# Altium schematic sheet Muller-C1.SchDoc
size 429 x 344 mm
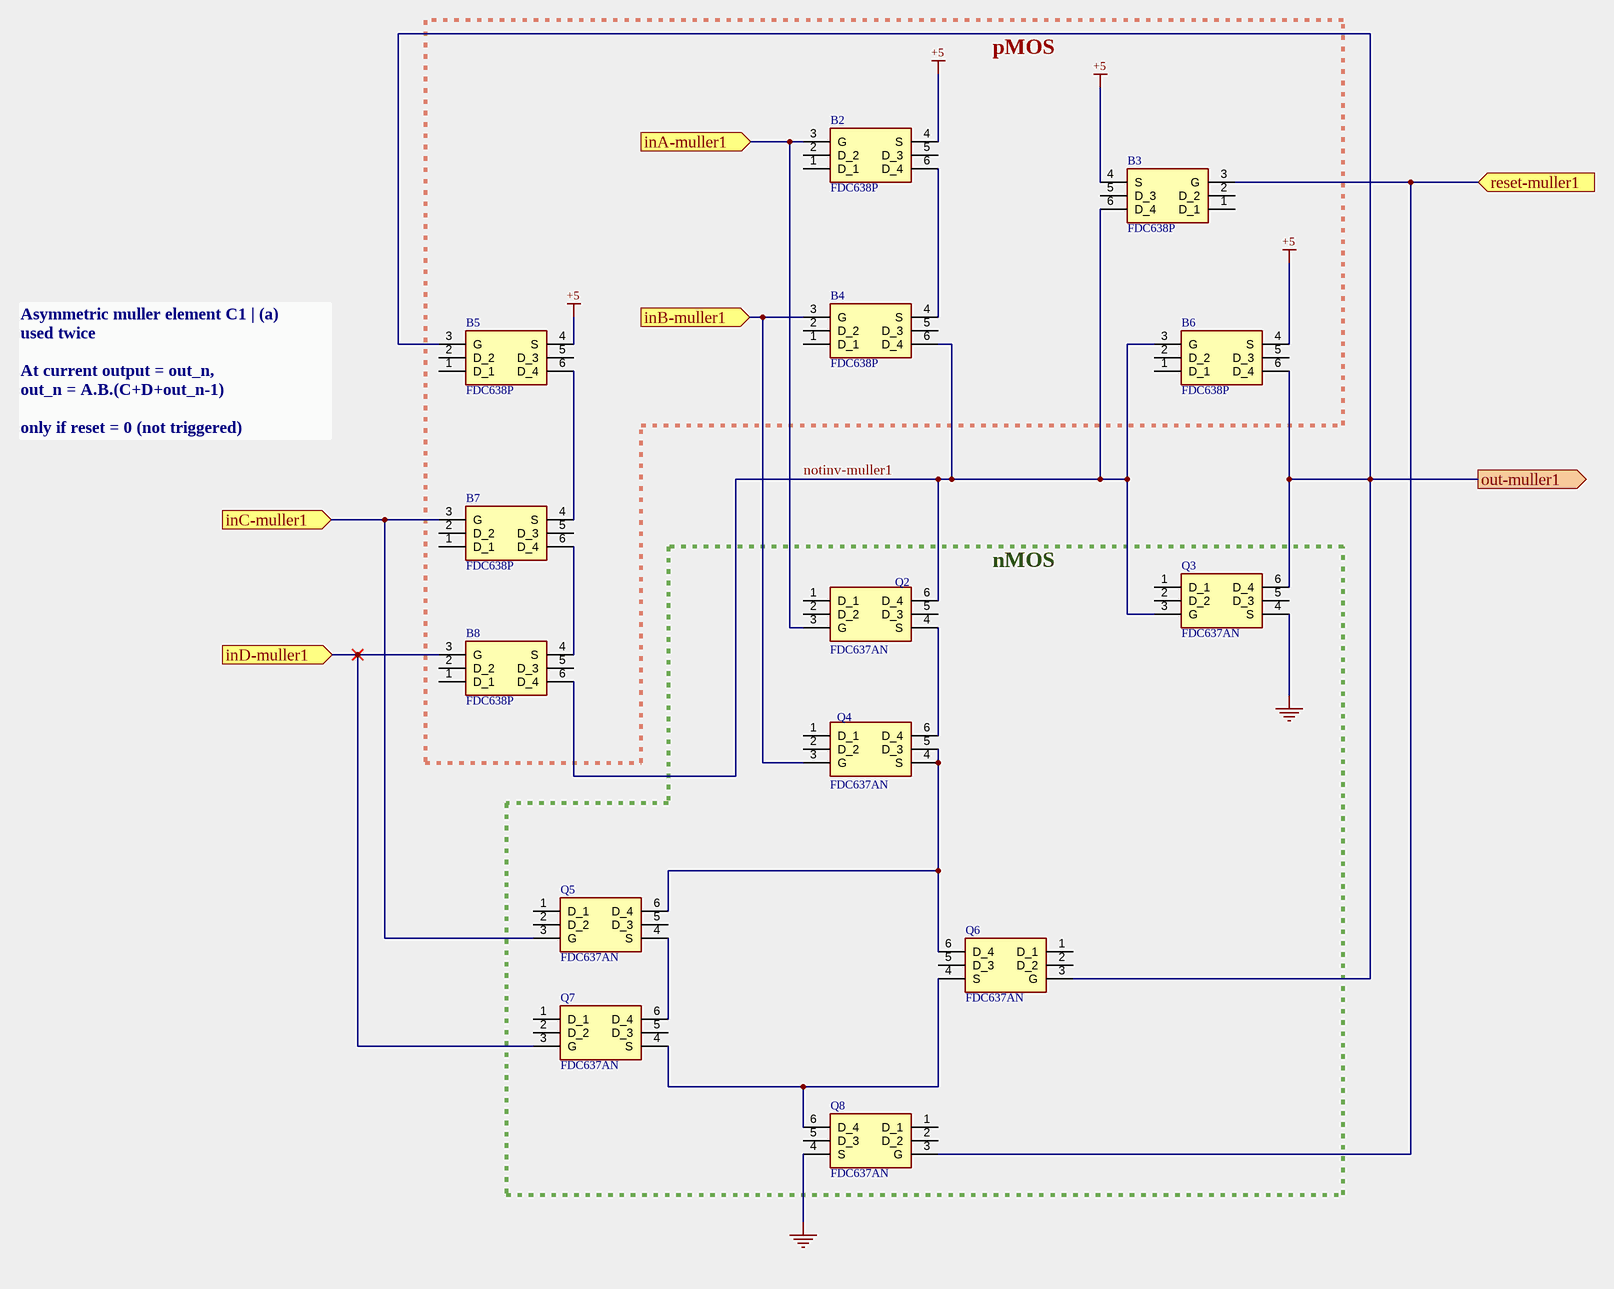
[diagram p0: Muller-C1.SchDoc]

## Parts
B2  FDC638P  [SOT95P275X110-6N]
B3  FDC638P  [SOT95P275X110-6N]
B4  FDC638P  [SOT95P275X110-6N]
B5  FDC638P  [SOT95P275X110-6N]
B6  FDC638P  [SOT95P275X110-6N]
B7  FDC638P  [SOT95P275X110-6N]
B8  FDC638P  [SOT95P275X110-6N]
Q2  FDC637AN  [SOT95P275X110-6N]
Q3  FDC637AN  [SOT95P275X110-6N]
Q4  FDC637AN  [SOT95P275X110-6N]
Q5  FDC637AN  [SOT95P275X110-6N]
Q6  FDC637AN  [SOT95P275X110-6N]
Q7  FDC637AN  [SOT95P275X110-6N]
Q8  FDC637AN  [SOT95P275X110-6N]

## Blocks framed on the sheet
pMOS: B2-B8
nMOS: Q2-Q8

## Ports
inA-muller1 (in), inB-muller1 (in), inC-muller1 (in), inD-muller1 (in), out-muller1 (out), reset-muller1 (in)

## Nets
+5: B2.4(S) B3.4(S) B5.4(S) B6.4(S)
GND: Q3.4(S) Q8.4(S)
inA-muller1: B2.3(G) Q2.3(G) ; port inA-muller1
inB-muller1: B4.3(G) Q4.3(G) ; port inB-muller1
inC-muller1: B7.3(G) Q5.3(G) ; port inC-muller1
inD-muller1: B8.3(G) Q7.3(G) ; port inD-muller1
notinv-muller1: B3.6(D_4) B4.6(D_4) B6.3(G) B8.6(D_4) Q2.6(D_4) Q3.3(G)
out-muller1: B5.3(G) B6.6(D_4) Q3.6(D_4) Q6.3(G) ; port out-muller1
reset-muller1: B3.3(G) Q8.3(G) ; port reset-muller1
NetB2_6: B2.6(D_4) B4.4(S)
NetB5_6: B5.6(D_4) B7.4(S)
NetB7_6: B7.6(D_4) B8.4(S)
NetQ2_4: Q2.4(S) Q4.6(D_4)
NetQ4_4: Q4.4(S) Q4.5(D_3) Q5.6(D_4) Q6.6(D_4)
NetQ5_4: Q5.4(S) Q7.6(D_4)
NetQ6_4: Q6.4(S) Q7.4(S) Q8.6(D_4)

Not connected (* = marked no-connect by the designer): B2 1(D_1) 2(D_2) 5(D_3); B3 1(D_1) 2(D_2) 5(D_3); B4 1(D_1) 2(D_2) 5(D_3); B5 1(D_1) 2(D_2) 5(D_3); B6 1(D_1) 2(D_2) 5(D_3); B7 1(D_1) 2(D_2) 5(D_3); B8 1(D_1) 2(D_2) 5(D_3); Q2 1(D_1) 2(D_2) 5(D_3); Q3 1(D_1) 2(D_2) 5(D_3); Q4 1(D_1) 2(D_2); Q5 1(D_1) 2(D_2) 5(D_3); Q6 1(D_1) 2(D_2) 5(D_3); Q7 1(D_1) 2(D_2) 5(D_3); Q8 1(D_1) 2(D_2) 5(D_3)

## Notes on the sheet
- Asymmetric muller element C1 | (a)
  used twice
  At current output = out_n,
  out_n = A.B.(C+D+out_n-1)
  only if reset = 0 (not triggered)

## Library data of the parts
B2-B8 = CMP-007-000000-1: Low gate charge (10 nC typical); Manufacturer_Name: onsemi; Geometry.Height: 1.1mm; Datasheet Link: https://www.onsemi.com/pub/Collateral/FDC638P-D.PDF; Arrow Price/Stock: *; Design Item ID: FDC638P; Mouser Part Number: 512-FDC638P; Manufacturer_Part_Number: FDC638P; Mouser Price/Stock: https://www.mouser.co.uk/ProductDetail/onsemi-Fairchild/FDC638P?qs=FOlmdCx%252BAA16kOuf%252Brkheg%3D%3D; Source: FDC638P.SchLib; Arrow Part Number: *
Q2-Q8 = CMP-005-000000-4: Low gate charge (10.5nC typical).; Manufacturer_Name: onsemi; Geometry.Height: 1.1mm; Mouser Part Number: 512-FDC637AN; Source: FDC637AN.SchLib; Arrow Part Number: FDC637AN; Datasheet Link: https://www.onsemi.com/pub/Collateral/FDC637AN-D.PDF; Arrow Price/Stock: https://www.arrow.com/en/products/fdc637an/on-semiconductor?region=nac; Manufacturer_Part_Number: FDC637AN; Mouser Price/Stock: https://www.mouser.co.uk/ProductDetail/ON-Semiconductor-Fairchild/FDC637AN?qs=utFvTgNEmG6iAEUdTAueXw%3D%3D; Design Item ID: FDC637AN